# Altium schematic sheet Programming Circuit.SchDoc
size A; SheetNumber: 9; SheetTotal: 14
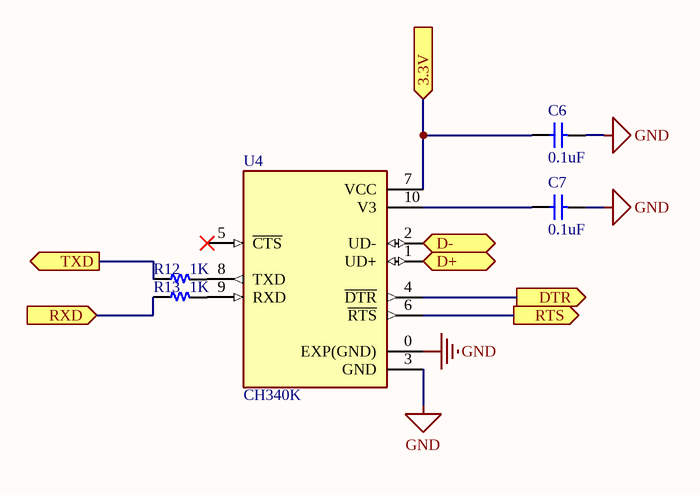
[diagram p0: Programming Circuit.SchDoc]

## Parts
C6  0.1uF  [C 0805]
C7  0.1uF  [C 0805]
R12  1K  [R 0805]
R13  1K  [R 0805]
U4  CH340K  [SOP100P600X160-11N]

## Ports
3.3V (in, see ESP32[4B], Ecternal I2C[2B], MLX Sensor[2B], Navigation switches[2B], Regulator 3.3V[3A], SD card[3B]), D+ (bidir, see ESP32[4B], USB Input[3B]), D- (bidir, see ESP32[4B], USB Input[3B]), DTR (out, see ESP32[3B], Auto Reset Circuit[3B]), RTS (out, see ESP32[3B], Auto Reset Circuit[2B]), RXD (in, see ESP32[4B]), TXD (out, see ESP32[3B])

## Nets
GND: C6.1 C7.1 U4.0(EXP(GND)) U4.3(GND)
3.3V: C6.2 U4.7(VCC) ; port 3.3V
D+: U4.1(UD+) ; port D+
D-: U4.2(UD-) ; port D-
DTR: U4.4(~{DTR}) ; port DTR
RTS: U4.6(~{RTS}) ; port RTS
RXD: R13.1 ; port RXD
TXD: R12.1 ; port TXD
NetC7_2: C7.2 U4.10(V3)
NetR12_2: R12.2 U4.8(TXD)
NetR13_2: R13.2 U4.9(RXD)

Not connected (* = marked no-connect by the designer): U4 5(~{CTS})*

## Library data of the parts
C6 C7 = Capacitor NP: Capacitor non-pol
R12 R13 = Resistor
U4 = CH340K: USB to Serial Port Chip; MF: WCH; SnapEDA_Link: https://www.snapeda.com/parts/CH340K/WCH/view-part/?ref=snap; Package: Package; Value: *; MP: CH340K; Check_prices: https://www.snapeda.com/parts/CH340K/WCH/view-part/?ref=eda